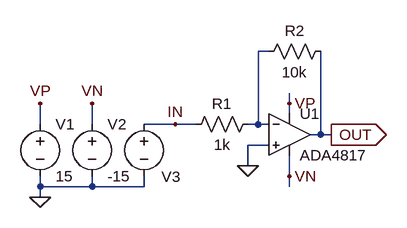
[diagram p0: schematic zoufuku.asc]
zoufuku.asc, the LTspice schematic file:
Version 4
SHEET 1 880 680
WIRE 288 -32 272 -32
WIRE 320 48 320 32
WIRE 320 64 320 48
WIRE -64 80 -64 48
WIRE 16 80 16 48
WIRE 144 80 96 80
WIRE 176 80 144 80
WIRE 272 80 272 -32
WIRE 272 80 256 80
WIRE 288 80 272 80
WIRE 368 96 368 -32
WIRE 368 96 352 96
WIRE 384 96 368 96
WIRE 288 112 256 112
WIRE 256 144 256 112
WIRE 320 160 320 128
WIRE -64 176 -64 160
WIRE 16 176 16 160
WIRE 16 176 -64 176
WIRE 96 176 96 160
WIRE 96 176 16 176
WIRE 320 176 320 160
WIRE -64 192 -64 176
FLAG 256 144 0
FLAG -64 192 0
FLAG 384 96 OUT
IOPIN 384 96 Out
FLAG 320 48 VP
FLAG -64 48 VP
FLAG 16 48 VN
FLAG 320 160 VN
FLAG 144 80 IN
SYMBOL OpAmps/ADA4817 320 32 R0
SYMATTR InstName U1
SYMBOL voltage -64 64 R0
WINDOW 123 0 0 Left 0
WINDOW 39 0 0 Left 0
SYMATTR InstName V1
SYMATTR Value 15
SYMBOL voltage 16 64 R0
WINDOW 123 0 0 Left 0
WINDOW 39 0 0 Left 0
SYMATTR InstName V2
SYMATTR Value -15
SYMBOL voltage 96 64 R0
WINDOW 123 24 124 Left 2
WINDOW 39 0 0 Left 0
WINDOW 3 24 44 Left 2
WINDOW 0 27 97 Left 2
SYMATTR Value ""
SYMATTR InstName V3
SYMBOL res 272 64 R90
WINDOW 0 0 56 VBottom 2
WINDOW 3 32 56 VTop 2
SYMATTR InstName R1
SYMATTR Value 1k
SYMBOL res 384 -48 R90
WINDOW 0 0 56 VBottom 2
WINDOW 3 32 56 VTop 2
SYMATTR InstName R2
SYMATTR Value 10k

The netlist it stands for:
* zoufuku.asc
XU1 0 N001 VP VN OUT ADA4817  ; pins In+ In- V+ V- OUT
V1 VP 0 15
V2 VN 0 -15
V3 IN 0
R1 N001 IN 1k
R2 OUT N001 10k
.backanno
.end